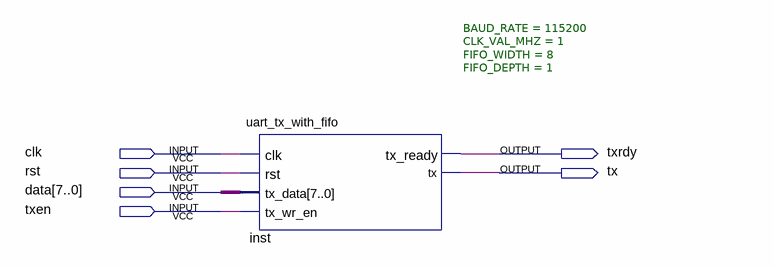
[diagram p0: schematic sheet]
// Quartus schematic uart_tx_fifo_test.bdf as structural Verilog: 1 symbols, 6 pins
module uart_tx_fifo_test (
  input  clk,
  input  rst,
  input  [7:0] data,
  input  txen,
  output txrdy,
  output tx
);

  uart_tx_with_fifo #(.BAUD_RATE(115200), .CLK_VAL_MHZ(1), .FIFO_WIDTH(8), .FIFO_DEPTH(1)) inst (
    .clk(clk), .rst(rst), .tx_data(data), .tx_wr_en(txen), .tx_ready(txrdy), .tx(tx));
endmodule
